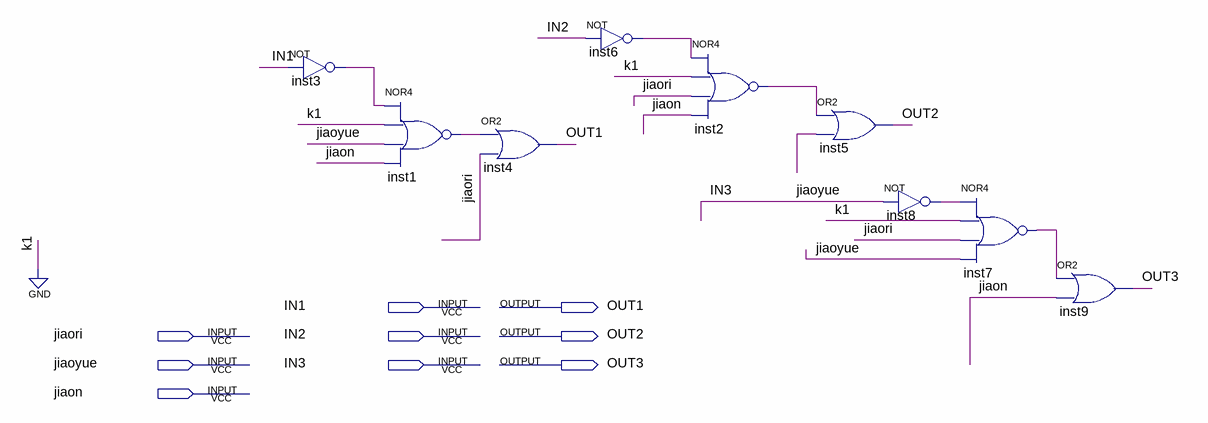
[diagram p0: schematic sheet]
// Quartus schematic rilijiaoshi.bdf as structural Verilog: 9 symbols, 9 pins
module rilijiaoshi (
  input  IN1,
  input  jiaori,
  input  IN2,
  input  jiaoyue,
  input  IN3,
  input  jiaon,
  output OUT1,
  output OUT2,
  output OUT3
);

  wire inst1_out, inst2_out, inst3_out, inst6_out, inst7_out, inst8_out;

  not inst3 (inst3_out, IN1);
  nor inst1 (inst1_out, inst3_out, 1'b0, jiaoyue, jiaon);
  or inst4 (OUT1, inst1_out, jiaori);
  not inst6 (inst6_out, IN2);
  nor inst2 (inst2_out, inst6_out, 1'b0, jiaori, jiaon);
  or inst5 (OUT2, inst2_out, jiaoyue);
  not inst8 (inst8_out, IN3);
  nor inst7 (inst7_out, inst8_out, 1'b0, jiaori, jiaoyue);
  or inst9 (OUT3, inst7_out, jiaon);
endmodule
